# Altium schematic sheet Nucleo-G431-Expansion-board.SchDoc
size 420 x 297 mm; SheetNumber: 2; SheetTotal: 2; PageSetup: Record=PageOptions¦CenterHorizontal=False¦CenterVertical=False¦PrintScale=0.95¦XCorrection=0.00¦YCorrection=0.00¦PrintKind=1¦BorderSize=5000000¦LeftOffset=0¦BottomOffset=0¦Orientation=1¦PaperLength=1000¦PaperWidth=1000¦Scale=100¦PaperSource=15¦PrintQuality=600¦MediaType=1¦DitherType=10¦PaperKind=A4¦PrintScaleMode=1; ProcessInspection: Ò.êîíòð.; NormInspection: Í.êîíòð.; Letter1Column: {}; Letter2Column: {}; Letter3Column: {}; DocumentType: Ñõåìà ýëåêòðè÷åñêàÿ ïðèíöèïèàëüíàÿ; AgreedBy: Ñîãëàñîâàë
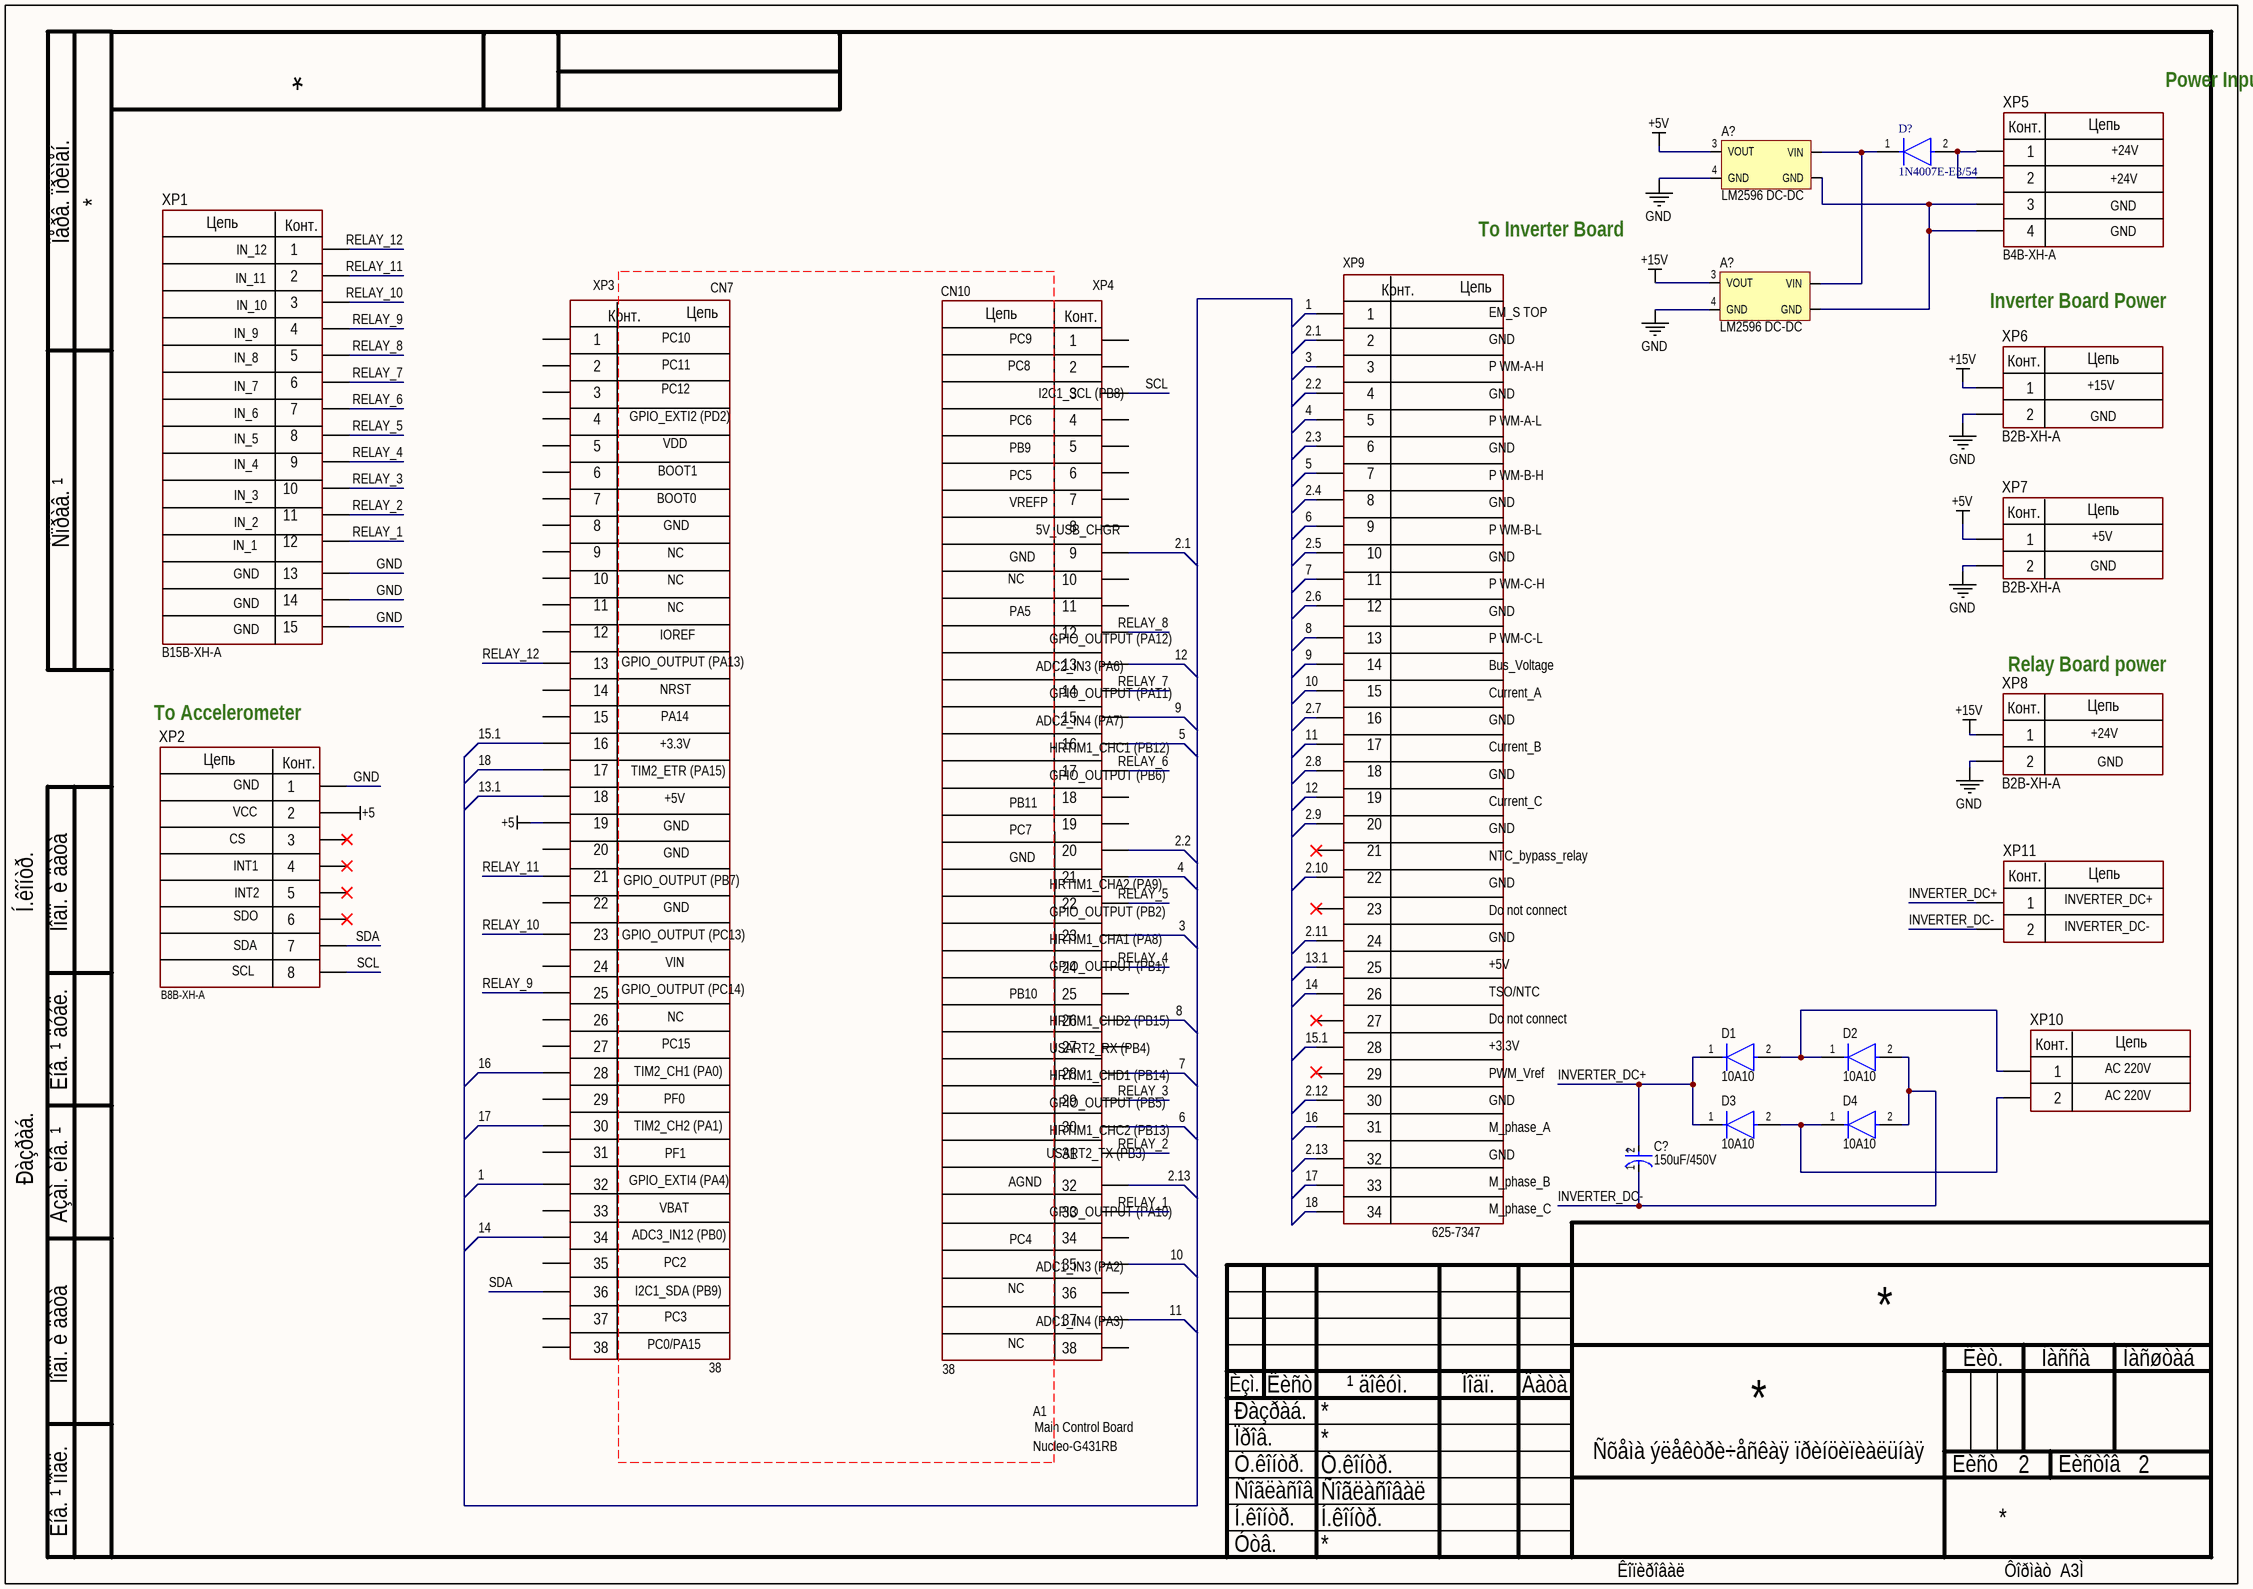
[diagram p0: Nucleo-G431-Expansion-board.SchDoc]

## Parts
(Parts that share a designator on the sheet are numbered #1, #2 ... from top to bottom, then left to right.)
A?#1  LM2596 DC-DC
A?#2  LM2596 DC-DC
C?  150uF/450V  [FP-RAD-TH-D_12_5_0_5-L_20-MFG]
CN7  38
CN10  38
D1  10A10  [FP-1N4007E-E3-54-MFG]
D2  10A10  [FP-1N4007E-E3-54-MFG]
D3  10A10  [FP-1N4007E-E3-54-MFG]
D4  10A10  [FP-1N4007E-E3-54-MFG]
D?  1N4007E-E3/54  [FP-1N4007E-E3-54-MFG]
XP1  B15B-XH-A
XP2  B8B-XH-A
XP5  B4B-XH-A
XP6  B2B-XH-A
XP7  B2B-XH-A
XP8  B2B-XH-A
XP9  625-7347
XP10  B2B-XH-A  (value not drawn)
XP11  B2B-XH-A  (value not drawn)

## Nets
+5: CN7.19 XP2.2
+5V: A?#1.3(VOUT) XP7.1
+15V: A?#2.3(VOUT) XP6.1 XP8.1
GND: A?#1.4(GND) A?#2.4(GND) XP1.13 XP1.14 XP1.15 XP2.1 XP6.2 XP7.2 XP8.2
1: CN7.32 XP9.1
2.1: CN10.9 XP9.2
2.2: CN10.20 XP9.4
2.3: XP9.6
2.4: XP9.8
2.5: XP9.10
2.6: XP9.12
2.7: XP9.16
2.8: XP9.18
2.9: XP9.20
2.10: XP9.22
2.11: XP9.24
2.12: XP9.30
2.13: CN10.32 XP9.32
3: CN10.23 XP9.3
4: CN10.21 XP9.5
5: CN10.16 XP9.7
6: CN10.30 XP9.9
7: CN10.28 XP9.11
8: CN10.26 XP9.13
9: CN10.15 XP9.14
10: CN10.35 XP9.15
11: CN10.37 XP9.17
12: CN10.13 XP9.19
13.1: CN7.18 XP9.25
14: CN7.34 XP9.26
15.1: CN7.16 XP9.28
16: CN7.28 XP9.31
17: CN7.30 XP9.33
18: CN7.17 XP9.34
INVERTER_DC+: C?.2(A) D1.1(C) D3.1(C) XP11.1
INVERTER_DC-: C?.1(C) D2.2(A) D4.2(A) XP11.2
RELAY_1: CN10.33 XP1.12
RELAY_2: CN10.31 XP1.11
RELAY_3: CN10.29 XP1.10
RELAY_4: CN10.24 XP1.9
RELAY_5: CN10.22 XP1.8
RELAY_6: CN10.17 XP1.7
RELAY_7: CN10.14 XP1.6
RELAY_8: CN10.12 XP1.5
RELAY_9: CN7.25 XP1.4
RELAY_10: CN7.23 XP1.3
RELAY_11: CN7.21 XP1.2
RELAY_12: CN7.13 XP1.1
SCL: CN10.3 XP2.8
SDA: CN7.36 XP2.7
NetA?#1_1: A?#1.1(VIN) A?#2.1(VIN) D?.1(C)
NetA?#1_2: A?#1.2(GND) A?#2.2(GND) XP5.3 XP5.4
NetD1_2: D1.2(A) D2.1(C) XP10.1
NetD3_2: D3.2(A) D4.1(C) XP10.2
NetD?_2: D?.2(A) XP5.1 XP5.2

Not connected (* = marked no-connect by the designer): CN7 1 2 3 4 5 6 7 8 9 10 11 12 14 15 20 22 24 26 27 29 31 33 35 37 38; CN10 1 2 4 5 6 7 8 10 11 18 19 25 27 34 36 38; XP2 3* 4* 5* 6*; XP9 21* 23* 27* 29

## Notes on the sheet
- Power Input
- +24V
- IN_12
- To Inverter Board
- GND
- IN_11
- IN_10
- (near CN7) XP3
- (near CN10) XP4
- EM_S TOP
- Inverter Board Power
- IN_8
- IN_9
- IN_7
- PC12
- PC10
- PC11
- PC8
- PC9
- I2C1_SCL (PB8)
- P WM-A-H
- +15V
- IN_5
- IN_6
- GPIO_EXTI2 (PD2)
- VDD
- PC6
- PB9
- P WM-A-L
- IN_3
- IN_4
- IN_2
- BOOT0
- BOOT1
- PC5
- VREFP
- P WM-B-H
- IN_1
- NC
- 5V_USB_CHGR
- P WM-B-L
- P WM-C-H
- +5V
- (near CN7) GPIO_OUTPUT (PA13)
- IOREF
- PA5
- (near CN10) GPIO_OUTPUT (PA12)
- P WM-C-L
- To Accelerometer
- NRST
- PA14
- ADC2_IN3 (PA6)
- ADC2_IN4 (PA7)
- (near CN10) GPIO_OUTPUT (PA11)
- Bus_Voltage
- Current_A
- Relay Board power
- TIM2_ETR (PA15)
- +3.3V
- (near CN10) HRTIM1_CHC1 (PB12)
- (near CN10) GPIO_OUTPUT (PB6)
- Current_B
- CS
- VCC
- PB11
- PC7
- (near XP9) NTC_bypass_relay
- Current_C
- INT1
- SDO
- INT2
- (near CN7) GPIO_OUTPUT (PB7)
- (near CN10) HRTIM1_CHA2 (PA9)
- (near CN10) GPIO_OUTPUT (PB2)
- (near XP9) Do not connect
- SCL
- SDA
- (near CN7) GPIO_OUTPUT (PC14)
- (near CN7) GPIO_OUTPUT (PC13)
- VIN
- PB10
- (near CN10) HRTIM1_CHA1 (PA8)
- (near CN10) GPIO_OUTPUT (PB1)
- TSO/NTC
- PC15
- (near CN10) HRTIM1_CHD2 (PB15)
- (near CN10) USART2_RX (PB4)
- AC 220V
- TIM2_CH2 (PA1)
- TIM2_CH1 (PA0)
- PF0
- (near CN10) HRTIM1_CHC2 (PB13)
- (near CN10) HRTIM1_CHD1 (PB14)
- (near CN10) GPIO_OUTPUT (PB5)
- M_phase_A
- PWM_Vref
- GPIO_EXTI4 (PA4)
- PF1
- AGND
- USART2_TX (PB3)
- M_phase_B
- ADC3_IN12 (PB0)
- VBAT
- PC2
- PC4
- ADC1_IN3 (PA2)
- (near CN10) GPIO_OUTPUT (PA10)
- M_phase_C
- I2C1_SDA (PB9)
- PC3
- ADC1_IN4 (PA3)
- PC0/PA15
- A1
- Nucleo-G431RB
- Main Control Board
- Labels drawn without touching a wire or pin: INVERTER_DC+, INVERTER_DC-
- Ïåðâ. ïðèìåí.
- Ñïðàâ. ¹
- Í.êîíòð.
- Ïîäï. è äàòà
- Èíâ. ¹ äóáë.
- Ðàçðàá.
- Âçàì. èíâ. ¹
- Èçì.
- Ëèñò
- ¹ äîêóì.
- Ïîäï.
- Äàòà
- Ëèò.
- Ìàññà
- Ìàñøòàá
- Ïðîâ.
- Ò.êîíòð.
- Ëèñòîâ
- Èíâ. ¹ ïîäë.
- Óòâ.
- Ñîãëàñîâ.
- Êîïèðîâàë
- Ôîðìàò  A3Ì
- (in symbol 2) Конт.; Цепь
- (in symbol 4) Цепь; Конт.
- (in symbol 8) Цепь; Конт.
- (in symbol 15) Цепь; Конт.
- (in symbol 34) Цепь; Конт.
- (in symbol 38) Цепь; Конт.
- (in symbol CMP-05427-000677-1) +

## Library data of the parts
A?#1 A?#2 = LM2596-DC-DC
C? = CMP-05427-000677-1: Aluminum Electrolytic Capacitors (Radial Lead Type) 10uF ±20% 450V; Ripple Current: 130mA; Lead Diameter: 0.6mm; Life (Hours): 2000Hour; Lead/Base Style: Straight; Package Quantity: 500; Radiation Hardening: No; Series: M; Voltage Rating (DC): 450V; Voltage Rating: 450V; Lead Pitch: 5mm; Height - Seated (Max): 0.866inch; Max Operating Temperature: 85°C; Termination: Radial; Case/Package: Radial; Capacitance: 10uF; Min Operating Temperature: -25°C; Tolerance: 20%; Length: 20mm; Mount: Through Hole; Height: 20mm; Packaging: Ammo Pack; Diameter: 12.5mm; RoHS Compliant: Yes
D1-D4 D? = CMP-02540-000087-1: DIODE GEN PURP 1KV 1A DO204AL; Peak Non-Repetitive Surge Current: 45A; Forward Voltage: 1.1V; Element Configuration: Single; Max Reverse Current: 5uA; Max Repetitive Reverse Voltage (Vrrm): 1kV; RoHS Compliant: Yes; Max Surge Current: 45A; Min Operating Temperature: -50°C; Radiation Hardening: No; Average Rectified Current: 1A; Series: -; Packaging: Tape and Reel; Contact Plating: Tin; Package Quantity: 5500; Max Reverse Voltage (DC): 1kV; Reverse Voltage: 1kV; Number of Pins: 2; Max Operating Temperature: 150°C; Case/Package: DO-41; Mount: Through Hole
XP1 = 15
XP2 = 8
XP5 = 4
XP6-XP8 XP10 XP11 = 2
XP9 = 34